# Altium project ESP32.PrjPcb
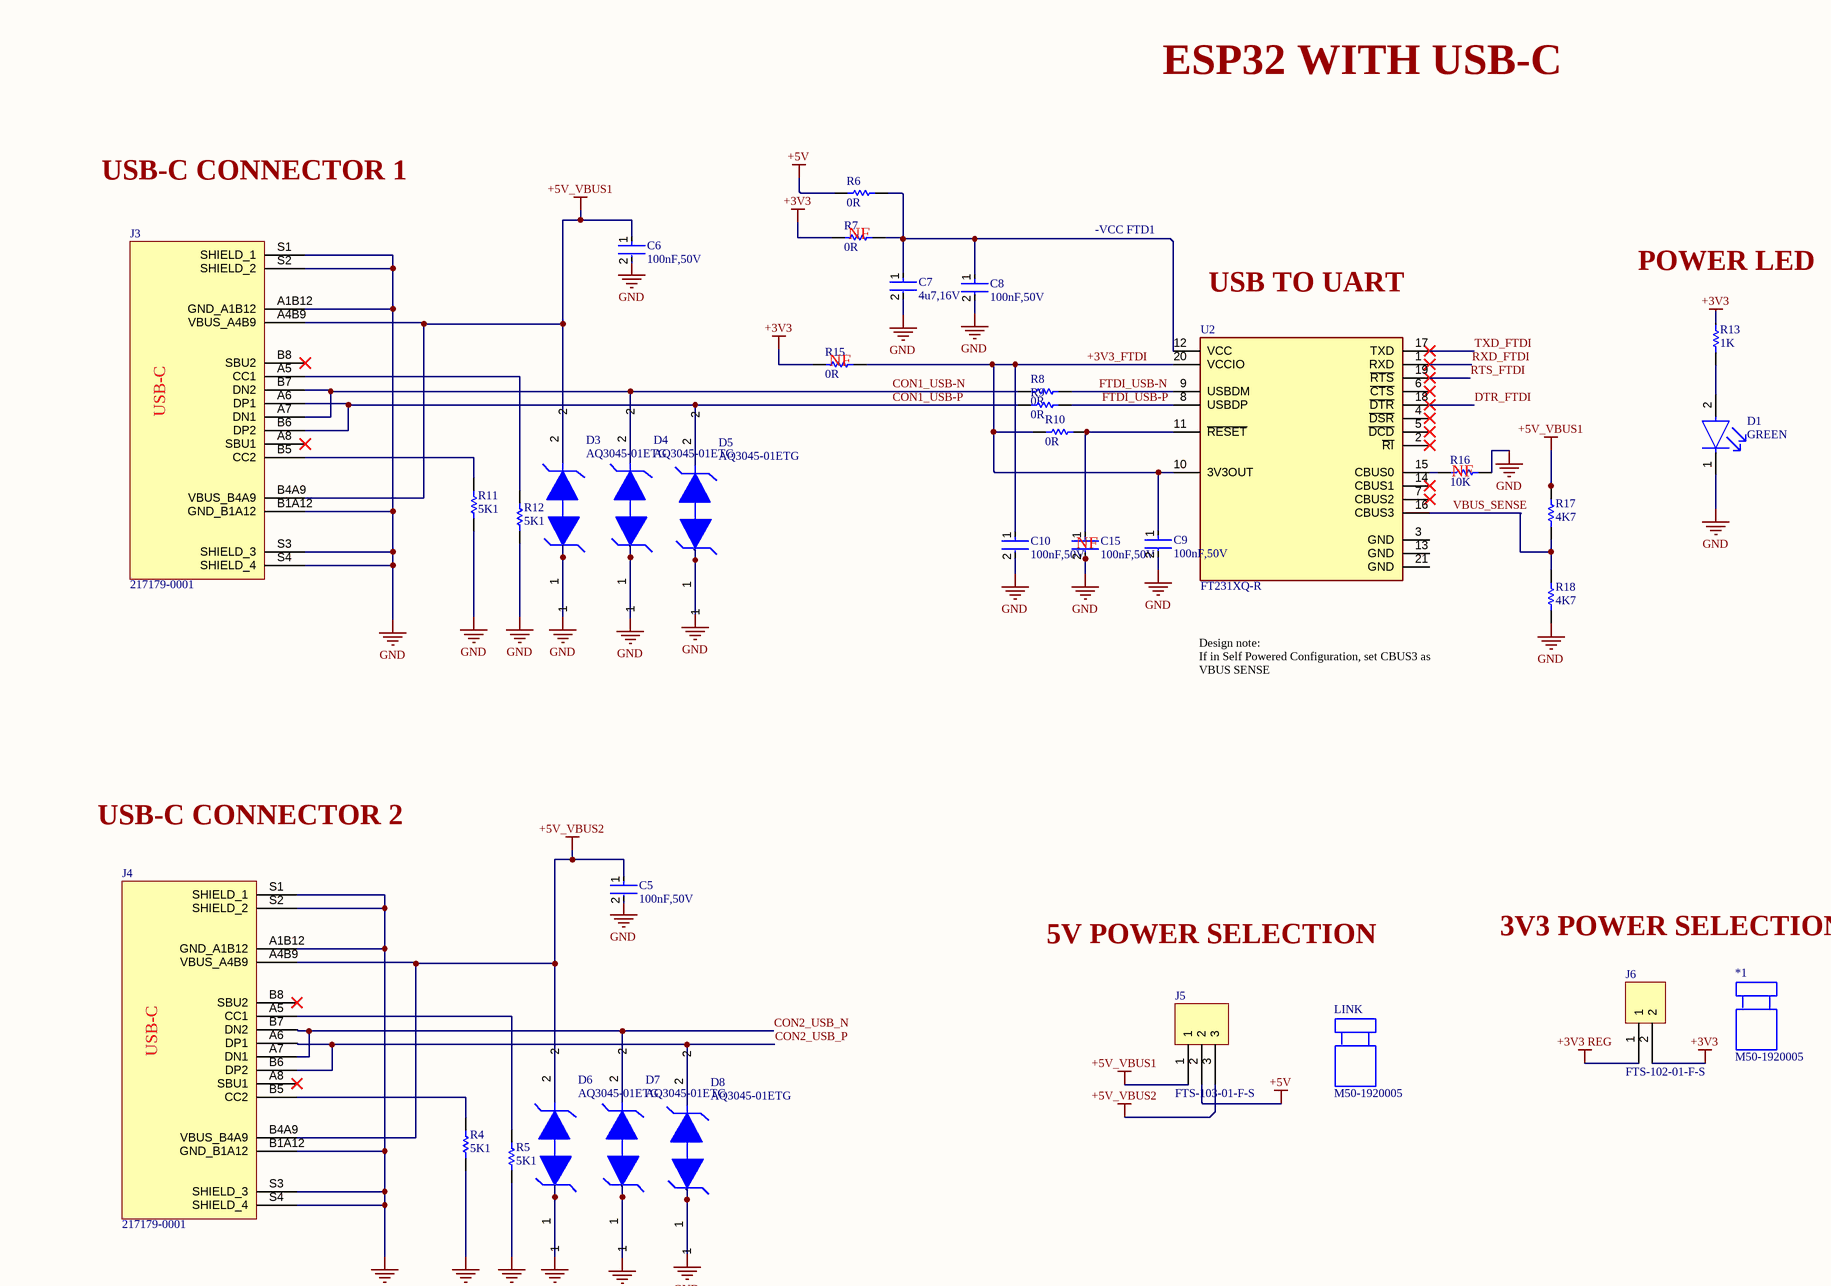
[diagram p0: Schematic.SchDoc, top left]
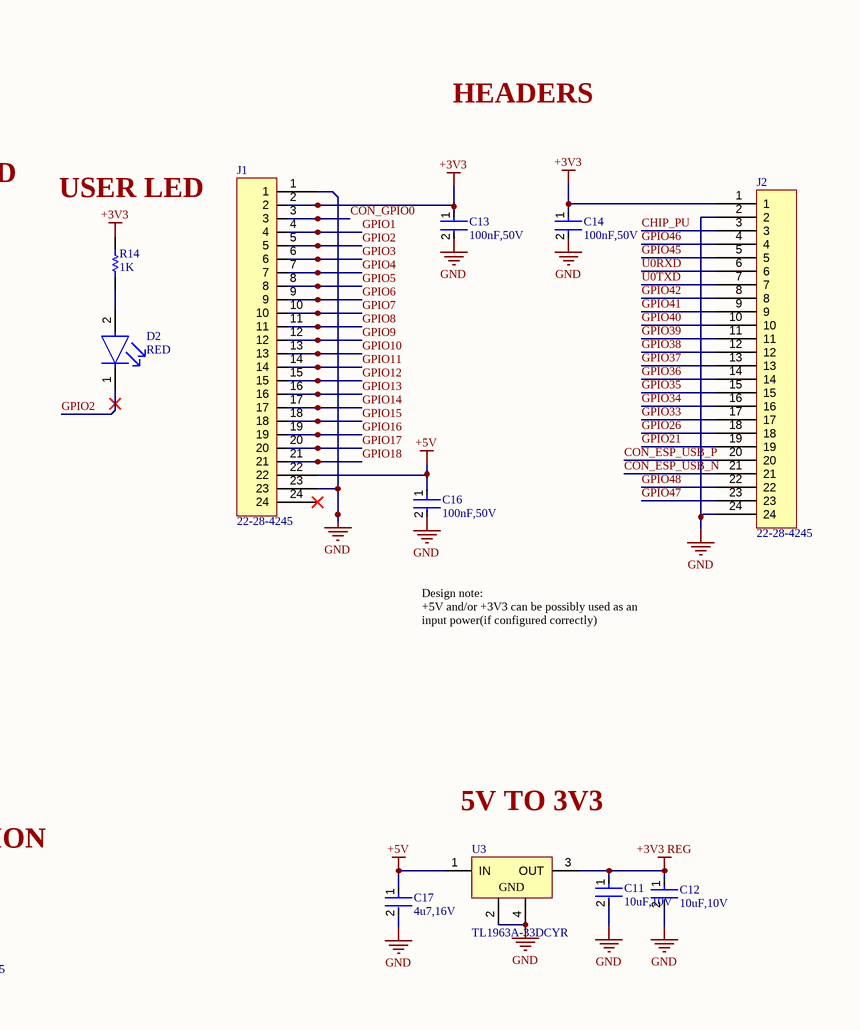
[diagram p1: Schematic.SchDoc, top right]
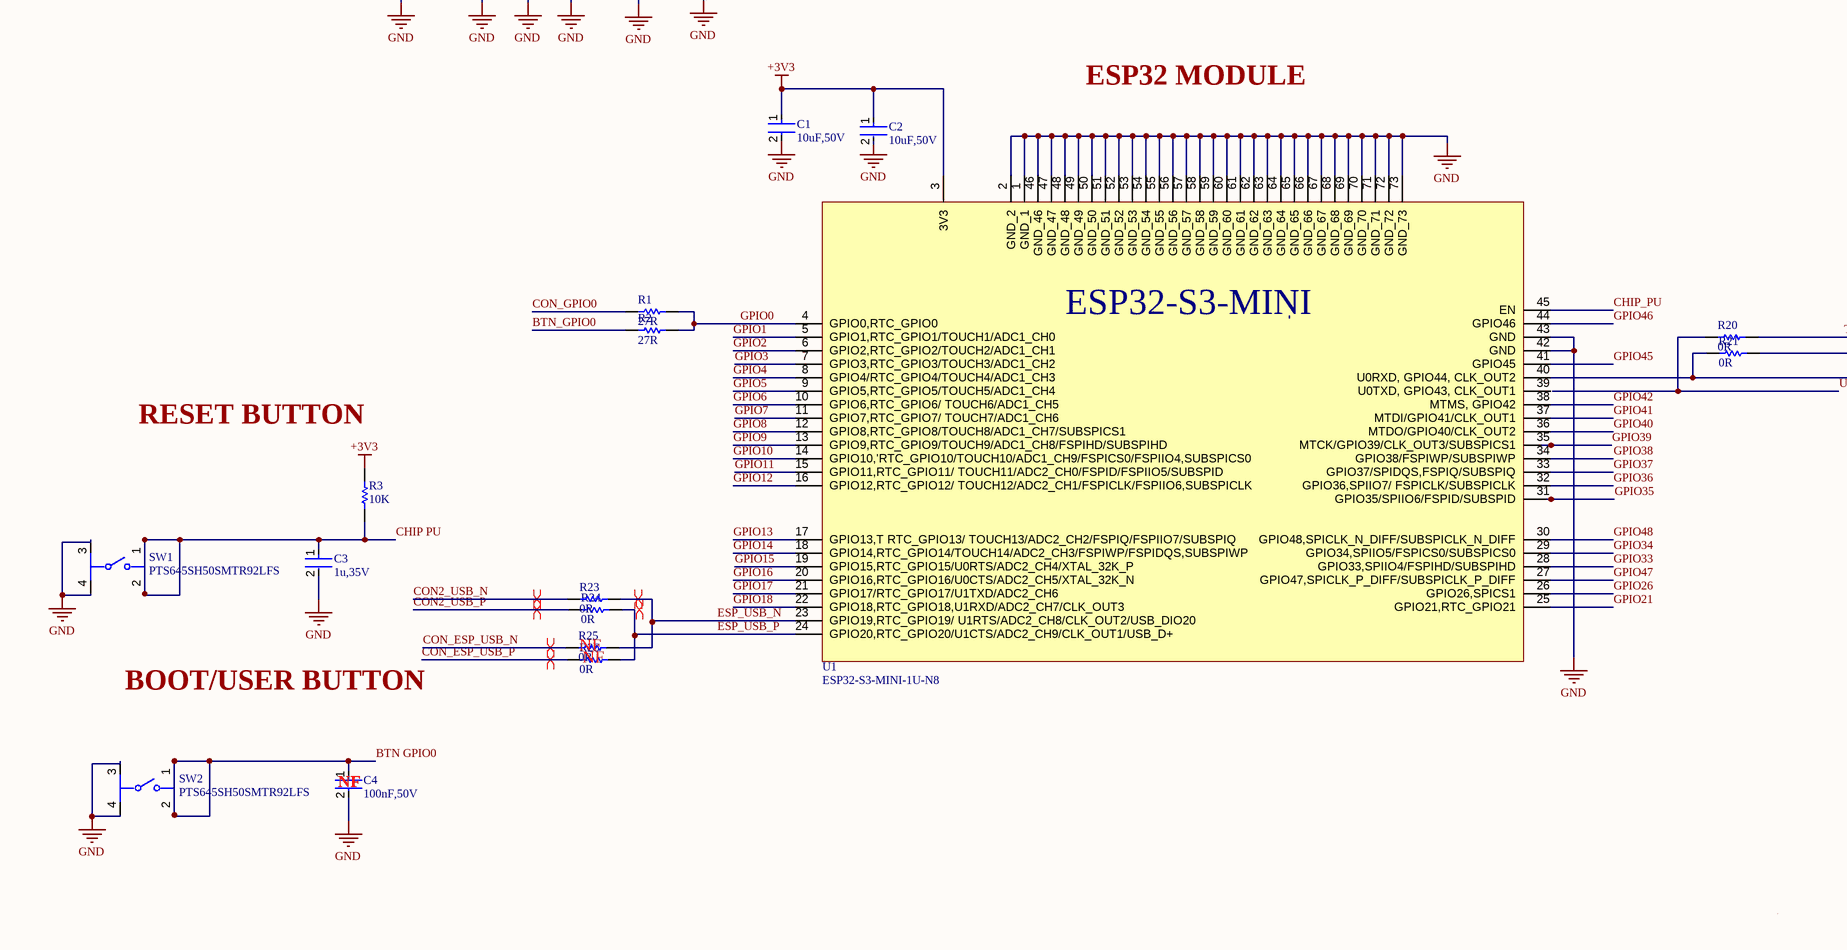
[diagram p2: Schematic.SchDoc, bottom left]
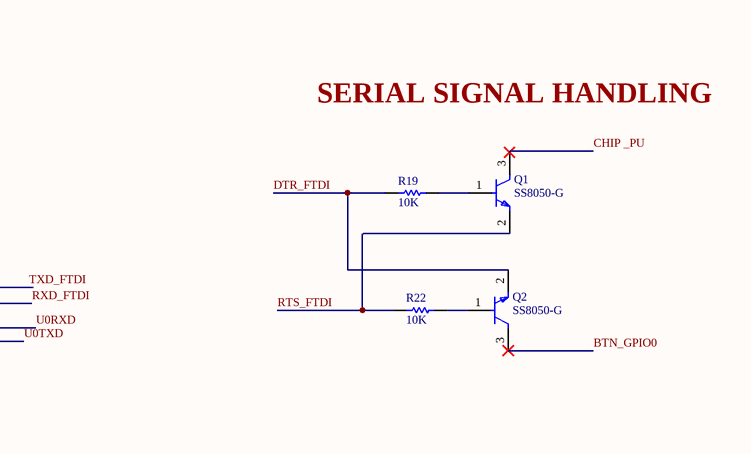
[diagram p3: Schematic.SchDoc, bottom right]
1 sheet, 66 parts. Net scope: global (net labels, ports and power ports of the same name join across sheets).
Board file: PCB.PcbDoc

## Sheet Schematic.SchDoc
size 558 x 431 mm; SheetNumber: 1; SheetTotal: 1

### Parts
*1  M50-1920005  (mechanical)
C1  10uF,50V  [FP-CL10-0_1-IPC_A]
C2  10uF,50V  [FP-CL10-0_1-IPC_A]
C3  1u,35V  [FP-CL10-0_1-IPC_A]
C4  100nF,50V  [FP-CL10-0_1-IPC_A]
C5  100nF,50V  [FP-CL10-0_1-IPC_A]
C6  100nF,50V  [FP-CL10-0_1-IPC_A]
C7  4u7,16V  [FP-CL10-0_1-IPC_A]
C8  100nF,50V  [FP-CL10-0_1-IPC_A]
C9  100nF,50V  [FP-CL10-0_1-IPC_A]
C10  100nF,50V  [FP-CL10-0_1-IPC_A]
C11  10uF,10V  [FP-CL10-0_1-IPC_A]
C12  10uF,10V  [FP-CL10-0_1-IPC_A]
C13  100nF,50V  [FP-CL10-0_1-IPC_A]
C14  100nF,50V  [FP-CL10-0_1-IPC_A]
C15  100nF,50V  [FP-CL10-0_1-IPC_A]
C16  100nF,50V  [FP-CL10-0_1-IPC_A]
C17  4u7,16V  [FP-CL10-0_1-IPC_A]
D1  GREEN  [FP-LTST-C190GKT-MFG]
D2  RED  [FP-LTST-C190GKT-MFG]
D3  AQ3045-01ETG  [SOD882]
D4  AQ3045-01ETG  [SOD882]
D5  AQ3045-01ETG  [SOD882]
D6  AQ3045-01ETG  [SOD882]
D7  AQ3045-01ETG  [SOD882]
D8  AQ3045-01ETG  [SOD882]
J1  22-28-4245  [HDR_1X24_2.54MM - duplicate]
J2  22-28-4245  [HDR_1X24_2.54MM - duplicate]
J3  217179-0001  [FP-2171790001-MFG]
J4  217179-0001  [FP-2171790001-MFG]
J5  FTS-103-01-F-S  [HDR_1X3_1.27MM - duplicate]
J6  FTS-102-01-F-S  [HDR_1X2_1.27MM]
LINK  M50-1920005  (mechanical)
Q1  SS8050-G  [FP-SS8050-G-IPC_B]
Q2  SS8050-G  [FP-SS8050-G-IPC_B]
R1  27R  [RESC1609X50X30LL8T20]
R2  27R  [RESC1609X50X30LL8T20]
R3  10K  [RESC1609X50X30LL8T20]
R4  5K1  [RESC1609X50X30LL8T20]
R5  5K1  [RESC1609X50X30LL8T20]
R6  0R  [RESC1609X50X30LL8T20]
R7  0R  [RESC1609X50X30LL8T20]
R8  0R  [RESC1609X50X30LL8T20]
R9  0R  [RESC1609X50X30LL8T20]
R10  0R  [RESC1609X50X30LL8T20]
R11  5K1  [RESC1609X50X30LL8T20]
R12  5K1  [RESC1609X50X30LL8T20]
R13  1K  [RESC1609X50X30LL8T20]
R14  1K  [RESC1609X50X30LL8T20]
R15  0R  [RESC1609X50X30LL8T20]
R16  10K  [RESC1609X50X30LL8T20]
R17  4K7  [RESC1609X50X30LL8T20]
R18  4K7  [RESC1609X50X30LL8T20]
R19  10K  [RESC1609X50X30LL8T20]
R20  0R  [RESC1609X50X30LL8T20]
R21  0R  [RESC1609X50X30LL8T20]
R22  10K  [RESC1609X50X30LL8T20]
R23  0R  [RESC1609X50X30LL8T20]
R24  0R  [RESC1609X50X30LL8T20]
R25  0R  [RESC1609X50X30LL8T20]
R26  0R  [RESC1609X50X30LL8T20]
SW1  PTS645SH50SMTR92LFS  [FP-PTS645SH50SMTR92LFS-MFG]
SW2  PTS645SH50SMTR92LFS  [FP-PTS645SH50SMTR92LFS-MFG]
U1  ESP32-S3-MINI-1U-N8  [XCVR_ESP32-S3-MINI-1-N8]
U2  FT231XQ-R  [FP-QFN-20-IPC_A]
U3  TL1963A-33DCYR  [DCY0004A_M]

### Nets
+3V3: C1.1 C2.1 C13.1 C14.1 J1.2 J2.1 J6.2 R3.2 R7.1 R13.2 R14.2 R15.1 U1.3(3V3)
+3V3 REG: C11.1 C12.1 J6.1 U3.3(OUT)
+5V: C16.1 C17.1 J1.22 J5.2 R6.1 U3.1(IN)
+5V_VBUS1: C6.1 D3.2 J3.A4B9(VBUS_A4B9) J3.B4A9(VBUS_B4A9) J5.1 R17.2
+5V_VBUS2: C5.1 D6.2 J4.A4B9(VBUS_A4B9) J4.B4A9(VBUS_B4A9) J5.3
GND: C1.2 C2.2 C3.2 C4.2 C5.2 C6.2 C7.2 C8.2 C9.2 C10.2 C11.2 C12.2 C13.2 C14.2 C15.2 C16.2 C17.2 D1.1(C) D3.1 D4.1 D5.1 D6.1 D7.1 D8.1 J1.1 J1.23 J2.2 J2.24 J3.A1B12(GND_A1B12) J3.B1A12(GND_B1A12) J3.S1(SHIELD_1) J3.S2(SHIELD_2) J3.S3(SHIELD_3) J3.S4(SHIELD_4) J4.A1B12(GND_A1B12) J4.B1A12(GND_B1A12) J4.S1(SHIELD_1) J4.S2(SHIELD_2) J4.S3(SHIELD_3) J4.S4(SHIELD_4) R4.1 R5.1 R11.1 R12.1 R16.2 R18.1 SW1.3 SW1.4 SW2.3 SW2.4 U1.1(GND_1) U1.2(GND_2) U1.42(GND) U1.43(GND) U1.46(GND_46) U1.47(GND_47) U1.48(GND_48) U1.49(GND_49) U1.50(GND_50) U1.51(GND_51) U1.52(GND_52) U1.53(GND_53) U1.54(GND_54) U1.55(GND_55) U1.56(GND_56) U1.57(GND_57) U1.58(GND_58) U1.59(GND_59) U1.60(GND_60) U1.61(GND_61) U1.62(GND_62) U1.63(GND_63) U1.64(GND_64) U1.65(GND_65) U1.66(GND_66) U1.67(GND_67) U1.68(GND_68) U1.69(GND_69) U1.70(GND_70) U1.71(GND_71) U1.72(GND_72) U1.73(GND_73) U3.2(GND) U3.4(GND)
+3V3_FTDI: C9.1 C10.1 R10.1 R15.2 U2.10(3V3OUT) U2.20(VCCIO)
BTN GPIO0: C4.1 SW2.1 SW2.2
BTN_GPIO0: Q2.3(C) R2.1
CHIP _PU: Q1.3(C)
CHIP PU: C3.1 R3.1 SW1.1 SW1.2
CHIP_PU: J2.3 U1.45(EN)
CON1_USB-N: D4.2 J3.A7(DN1) J3.B7(DN2) R8.1
CON1_USB-P: D5.2 J3.A6(DP1) J3.B6(DP2) R9.1
CON2_USB_N: D7.2 J4.A7(DN1) J4.B7(DN2) R23.1
CON2_USB_P: D8.2 J4.A6(DP1) J4.B6(DP2) R24.1
CON_ESP_USB_N: J2.21 R25.1
CON_ESP_USB_P: J2.20 R26.1
CON_GPIO0: J1.3 R1.1
DTR_FTDI: Q2.2(E) R19.2 U2.18(~{DTR})
ESP_USB_N: R23.2 R25.2 U1.23(GPIO19,RTC_GPIO19/_U1RTS/ADC2_CH8/CLK_OUT2/USB_DIO20)
ESP_USB_P: R24.2 R26.2 U1.24(GPIO20,RTC_GPIO20/U1CTS/ADC2_CH9/CLK_OUT1/USB_D+)
FTDI_USB-N: R8.2 U2.9(USBDM)
FTDI_USB-P: R9.2 U2.8(USBDP)
GPIO0: R1.2 R2.2 U1.4(GPIO0,RTC_GPIO0)
GPIO1: J1.4 U1.5(GPIO1,RTC_GPIO1/TOUCH1/ADC1_CH0)
GPIO2: D2.1(C) J1.5 U1.6(GPIO2,RTC_GPIO2/TOUCH2/ADC1_CH1)
GPIO3: J1.6 U1.7(GPIO3,RTC_GPIO3/TOUCH3/ADC1_CH2)
GPIO4: J1.7 U1.8(GPIO4/RTC_GPIO4/TOUCH4/ADC1_CH3)
GPIO5: J1.8 U1.9(GPIO5,RTC_GPIO5/TOUCH5/ADC1_CH4)
GPIO6: J1.9 U1.10(GPIO6,RTC_GPIO6/_TOUCH6/ADC1_CH5)
GPIO7: J1.10 U1.11(GPIO7,RTC_GPIO7/_TOUCH7/ADC1_CH6)
GPIO8: J1.11 U1.12(GPIO8,RTC_GPIO8/TOUCH8/ADC1_CH7/SUBSPICS1)
GPIO9: J1.12 U1.13(GPIO9,RTC_GPIO9/TOUCH9/ADC1_CH8/FSPIHD/SUBSPIHD)
GPIO10: J1.13 U1.14(GPIO10,'RTC_GPIO10/TOUCH10/ADC1_CH9/FSPICS0/FSPIIO4,SUBSPICS0)
GPIO11: J1.14 U1.15(GPIO11,RTC_GPIO11/_TOUCH11/ADC2_CH0/FSPID/FSPIIO5/SUBSPID)
GPIO12: J1.15 U1.16(GPIO12,RTC_GPIO12/_TOUCH12/ADC2_CH1/FSPICLK/FSPIIO6,SUBSPICLK)
GPIO13: J1.16 U1.17(GPIO13,T_RTC_GPIO13/_TOUCH13/ADC2_CH2/FSPIQ/FSPIIO7/SUBSPIQ)
GPIO14: J1.17 U1.18(GPIO14,RTC_GPIO14/TOUCH14/ADC2_CH3/FSPIWP/FSPIDQS,SUBSPIWP)
GPIO15: J1.18 U1.19(GPIO15,RTC_GPIO15/U0RTS/ADC2_CH4/XTAL_32K_P)
GPIO16: J1.19 U1.20(GPIO16,RTC_GPIO16/U0CTS/ADC2_CH5/XTAL_32K_N)
GPIO17: J1.20 U1.21(GPIO17/RTC_GPIO17/U1TXD/ADC2_CH6)
GPIO18: J1.21 U1.22(GPIO18,RTC_GPIO18,U1RXD/ADC2_CH7/CLK_OUT3)
GPIO21: J2.19 U1.25(GPIO21,RTC_GPIO21)
GPIO26: J2.18 U1.26(GPIO26,SPICS1)
GPIO33: J2.17 U1.28(GPIO33,SPIIO4/FSPIHD/SUBSPIHD)
GPIO34: J2.16 U1.29(GPIO34,SPIIO5/FSPICS0/SUBSPICS0)
GPIO35: J2.15 U1.31(GPIO35/SPIIO6/FSPID/SUBSPID)
GPIO36: J2.14 U1.32(GPIO36,SPIIO7/_FSPICLK/SUBSPICLK)
GPIO37: J2.13 U1.33(GPIO37/SPIDQS,FSPIQ/SUBSPIQ)
GPIO38: J2.12 U1.34(GPIO38/FSPIWP/SUBSPIWP)
GPIO39: J2.11 U1.35(MTCK/GPIO39/CLK_OUT3/SUBSPICS1)
GPIO40: J2.10 U1.36(MTDO/GPIO40/CLK_OUT2)
GPIO41: J2.9 U1.37(MTDI/GPIO41/CLK_OUT1)
GPIO42: J2.8 U1.38(MTMS,_GPIO42)
GPIO45: J2.5 U1.41(GPIO45)
GPIO46: J2.4 U1.44(GPIO46)
GPIO47: J2.23 U1.27(GPIO47,SPICLK_P_DIFF/SUBSPICLK_P_DIFF)
GPIO48: J2.22 U1.30(GPIO48,SPICLK_N_DIFF/SUBSPICLK_N_DIFF)
RTS_FTDI: Q1.2(E) R22.2 U2.19(~{RTS})
RXD_FTDI: R21.2 U2.1(RXD)
TXD_FTDI: R20.2 U2.17(TXD)
U0RXD: J2.6 R21.1 U1.40(U0RXD,_GPIO44,_CLK_OUT2)
U0TXD: J2.7 R20.1
VBUS_SENSE: R17.1 R18.2 U2.16(CBUS3)
NetC7_1: C7.1 C8.1 R6.2 R7.2 U2.12(VCC)
NetC15_1: C15.1 R10.2 U2.11(~{RESET})
NetD1_2: D1.2(A) R13.1
NetD2_2: D2.2(A) R14.1
NetJ3_A5: J3.A5(CC1) R12.2
NetJ3_B5: J3.B5(CC2) R11.2
NetJ4_A5: J4.A5(CC1) R5.2
NetJ4_B5: J4.B5(CC2) R4.2
NetQ1_1: Q1.1(B) R19.1
NetQ2_1: Q2.1(B) R22.1
NetR16_1: R16.1 U2.15(CBUS0)

Not connected (* = marked no-connect by the designer): J1 24*; J3 A8(SBU1)* B8(SBU2)*; J4 A8(SBU1)* B8(SBU2)*; U1 39(U0TXD,_GPIO43,_CLK_OUT1); U2 2(~{RI})* 3(GND) 4(~{DSR})* 5(~{DCD})* 6(~{CTS})* 7(CBUS2)* 13(GND) 14(CBUS1)* 21(GND)

### Layout directives
differential pair; differential pair class DIFF90: CON2_USB_N, CON2_USB_P, CON_ESP_USB_N, CON_ESP_USB_P, ESP_USB_N, ESP_USB_P

### Notes on the sheet
- ESP32 WITH USB-C
- USB-C CONNECTOR 1
- HEADERS
- (near R7) NF
- -VCC FTD1
- (near U2) USB TO UART
- (near R13) POWER LED
- (near R14) USER LED
- (near R15) NF
- (near R16) NF
- (near C15) NF
- Design note:
  If in Self Powered Configuration, set CBUS3 as VBUS SENSE
- Design note:
  +5V and/or +3V3 can be possibly used as an input power(if configured correctly)
- USB-C CONNECTOR 2
- 5V TO 3V3
- 5V POWER SELECTION
- (near *1) 3V3 POWER SELECTION
- ESP32 MODULE
- SERIAL SIGNAL HANDLING
- RESET BUTTON
- NF
- BOOT/USER BUTTON
- (near C4) NF
- DWG. NO.
- REV.
- SHT.
- REVISION
- DESCRIPTION
- DATE
- APPROVED
- THIS DOCUMENT AND THE DATA DISCLOSED HEREIN OR HEREWITH IS THE PROPERTY OF ALTIUM LIMITED AND MAY BE FREELY DISTRIBUTED IN WHOLE. NO RIGHTS ARE RESERVED OR EXPRESS OR IMPLIED WARANTEE GIVEN.
- ENG:
- DSN:
- APPROVALS
- PROJECT
- DOCUMENT REVISION:
- DESIGN ITEM:
- CHK:
- BOM:
- REFERENCE DOCUMENTS
- PROJECT REVISION:
- TITLE
- FAB DWG:
- PCB DWG:
- ASSY DWG:
- SCALE:
- SIZE
- C
- CAGE CODE
- FILE NAME
- DWG NO.
- SHEET
- OF
- REV
- (in symbol 217179-0001) USB-C
- (in symbol ESP32-S3-MINI-1U-N8) ESP32-S3-MINI

### Library data of the parts
*1 LINK = M50-1920005: Jumper (Busbar), Jumper Socket, Pin Headers, 2, 1.27 Mm Rohs Compliant: Yes |Harwin M50-1920005; Manufacturer: Harwin; Supplier: Digikey; Supplier Part Number: 952-1727-ND; Manufacturer Part Number: M50-1920005; RoHS: Yes; Category: Headers and Wire Housings; Stock: 4363; Pricing: 1=0.33, 10=0.284, 25=0.2664, 50=0.2536, 100=0.2414, 250=0.22628, 500=0.21546, 1000=0.20516, 3000=0.18984 (USD); ComponentLink1URL: https://datasheet.ciiva.com/4573/m50-19x-350826-4573042.pdf?src-supplier=Mouser; ComponentLink1Description: https://datasheet.ciiva.com/4573/m50-19x-350826-4573042.pdf?src-supplier=Mouser; ComponentLink2URL: https://datasheet.ciiva.com/1456/m50-19x-1456640.pdf?src-supplier=Newark; ComponentLink2Description: https://datasheet.ciiva.com/1456/m50-19x-1456640.pdf?src-supplier=Newark; ComponentLink3URL: https://datasheet.ciiva.com/1412/1836978-1412125.pdf?src-supplier=Element14; ComponentLink3Description: https://datasheet.ciiva.com/1412/1836978-1412125.pdf?src-supplier=Element14; ComponentLink4URL: https://datasheet.ciiva.com/767/m50-19x-767921.pdf?src-supplier=Digikey; ComponentLink4Description: https://datasheet.ciiva.com/767/m50-19x-767921.pdf?src-supplier=Digikey
C1-C3 C7 C11 C12 C17 = CMP-13271-000011-1: CAP CER 0.1UF 50V X7R 0603; Manufacturer: Samsung Electro-Mechanics America, Inc; Manufacturer Part Number: CL10B104JB8NNNC; Value: 100nF; Material: Ceramic; Temperature Coefficient: 15%; Tolerance: 5%; Ipc Land Pattern Name: CAPC16080X80; Device Class L1: Passive Components; Digikey Description: CAP CER 0.1UF 50V X7R 0603; Voltage Rating: 50V; Height: 0.9mm; ComponentLink2Description: Datasheet; Device Class L2: Capacitors; ComponentLink2URL: http://www.samsungsem.com/kr/support/product-search/mlcc/__icsFiles/afieldfile/2019/06/18/CL10B104JB8NNNC-19.pdf; Temperature Characteristic: X7R; Temperature Range High: +125°C; Lead Free: Yes; Temperature Range Low: -55°C; Category: Cap; Package: CL10-0.1; Temperature: -55°C to +125°C; Octopart: https://octopart.com/cl10b104jb8nnnc-samsung-9302151; Device Class L3: Ceramic Capacitors; RoHS: TRUE; Automotive: No; Capacitance: 100nF
C4-C6 C8-C10 C13-C16 = CMP-13271-000011-1: CAP CER 0.1UF 50V X7R 0603; Manufacturer: Samsung Electro-Mechanics America, Inc; Manufacturer Part Number: CL10B104JB8NNNC; Material: Ceramic; Temperature Coefficient: 15%; Tolerance: 5%; Ipc Land Pattern Name: CAPC16080X80; Device Class L1: Passive Components; Digikey Description: CAP CER 0.1UF 50V X7R 0603; Voltage Rating: 50V; Height: 0.9mm; ComponentLink2Description: Datasheet; Device Class L2: Capacitors; ComponentLink2URL: http://www.samsungsem.com/kr/support/product-search/mlcc/__icsFiles/afieldfile/2019/06/18/CL10B104JB8NNNC-19.pdf; Temperature Characteristic: X7R; Value: 100nF; Temperature Range High: +125°C; Lead Free: Yes; Temperature Range Low: -55°C; Category: Cap; Package: CL10-0.1; Temperature: -55°C to +125°C; Octopart: https://octopart.com/cl10b104jb8nnnc-samsung-9302151; Device Class L3: Ceramic Capacitors; RoHS: TRUE; Automotive: No; Capacitance: 100nF
D1 D2 = CMP-22017-000005-2: LED GREEN CLEAR CHIP SMD; Dominant Wavelength: 569nm; Reverse Voltage: 5V; Lens Color: Colorless; Viewing Angle: 130°; Voltage: 2V; Forward Current: 30mA; Power Dissipation: 100mW; Luminous Intensity: 6mcd; Number of LEDs: 1; Forward Voltage: 2.1V; Wavelength: 565nm; Test Current: 10mA; Min Operating Temperature: -55°C; Lens Style: Clear; Mount: Surface Mount; Width: 0.8mm; Packaging: Tape and Reel; Lens Transparency: Clear; Case Code (Metric): 1608; Depth: 0.8mm; Case Code (Imperial): 0603; Case/Package: 0603; Number of Pins: 2; Max Operating Temperature: 85°C; Lead Free: Lead Free; Number of Elements: 1; Length: 1.6mm; Height: 0.8mm; Package Quantity: 1; Power Rating: 100mW; Radiation Hardening: No; Illumination Color: Green; Color: Green
D3-D8 = AQ3045-01ETG: TVS DIODE 12VC 3A SOD882 / ESD Suppressor TVS Bi-Dir 5.3V Automotive 2-Pin SOD-882 T/R; Manufacturer: Littelfuse; Number of Bidirectional Channels: 1; Min Breakdown Voltage: 6.8V; Peak Pulse Power: 40W; Power Line Protection: No; Diode Type: ZENER; Leakage Current: 100nA; Number of Channels: 1NUMBER; Supplier: Digikey; Supplier Part Number: F9321DKR-ND; Manufacturer Part Number: AQ3045-01ETG; RoHS: Yes; Category: TVS Diodes; Stock: 7460; Pricing: 1=0.45, 10=0.29, 100=0.141, 500=0.134, 1000=0.131 (USD); Mounting Technology: Surface Mount; Min Operating Temperature: -55°C; Max Operating Temperature: 150°C; Packaging: Cut Tape; Reverse Standoff Voltage: 5.3V; Peak Pulse Current: 3A; Series: Automotive, AEC-Q101, AQ3045, SPA®; Operating Supply Voltage: 5.3V; RoHS Compliant: Yes; ComponentLink1URL: https://www.littelfuse.com/~/media/electronics/datasheets/tvs_diode_arrays/littelfuse_tvs_diode_array_aq3045_datasheet.pdf.pdf?src-supplier=Digikey; ComponentLink1Description: https://www.littelfuse.com/~/media/electronics/datasheets/tvs_diode_arrays/littelfuse_tvs_diode_array_aq3045_datasheet.pdf.pdf?src-supplier=Digikey; ComponentLink2URL: http://www.littelfuse.com/~/media/electronics/datasheets/tvs_diode_arrays/littelfuse_tvs_diode_array_aq3045_datasheet.pdf.pdf?src-supplier=Digikey; ComponentLink2Description: http://www.littelfuse.com/~/media/electronics/datasheets/tvs_diode_arrays/littelfuse_tvs_diode_array_aq3045_datasheet.pdf.pdf?src-supplier=Digikey
J1 J2 = 22-28-4245: Conn Unshrouded Header HDR 24 POS 2.54mm Solder ST Thru-Hole KK® Bag; Manufacturer: Molex; Plating: Tin; Current Rating: 4A; Gender: Male; Number of Circuits: 24; Supplier: Digikey; Supplier Part Number: 900-0022284245-ND; Manufacturer Part Number: 22-28-4245; RoHS: No; Category: Headers and Wire Housings; Stock: 1547; Pricing: 1=1.21, 10=1.024, 100=0.8699, 500=0.77638, 1000=0.73932, 5000=0.65998, 10000=0.62851 (USD); Mounting Technology: Through Hole; Contact Material: Brass; Contact Plating: Gold; Housing Color: Black; Number of Contacts: 24; Number of Positions: 24; Number of Rows: 1; Orientation: Vertical; Packaging: Bulk; Termination: Solder; Pitch: 2.54mm; Lead Free: Lead Free; Reach SVHC Compliant: 4188SVHC; ComponentLink1URL: https://datasheet.ciiva.com/6814/022284363-sd-6814049.pdf?src-supplier=Digikey; ComponentLink1Description: https://datasheet.ciiva.com/6814/022284363-sd-6814049.pdf?src-supplier=Digikey; ComponentLink2URL: https://datasheet.ciiva.com/10075/0022284245-pcb-headers-10075617.pdf?src-supplier=Avnet; ComponentLink2Description: https://datasheet.ciiva.com/10075/0022284245-pcb-headers-10075617.pdf?src-supplier=Avnet; ComponentLink3URL: https://datasheet.ciiva.com/1433/1597854-1433759.pdf?src-supplier=Element14; ComponentLink3Description: https://datasheet.ciiva.com/1433/1597854-1433759.pdf?src-supplier=Element14
J3 J4 = 217179-0001: USB Connector, USB Type C, USB 2.0, Receptacle, 16 Ways, Surface Mount, Through Hole Mount; Manufacturer: Molex; USB Standard: USB 2.0; Current Rating: 1.25A; Number of Contacts: 16; Voltage Rating: 30V; Supplier: Digikey; Supplier Part Number: 900-2171790001CT-ND; Manufacturer Part Number: 217179-0001; RoHS: No; Category: Connectors; Stock: 19280; Pricing: 1=0.83, 10=0.704, 25=0.6596, 50=0.628, 100=0.598, 250=0.56052, 500=0.53374 (USD); Contact Material: Nickel,Gold; Min Operating Temperature: -40°C; Max Operating Temperature: 85°C; Gender: Receptacle; Height: 3.36mm
J5 = FTS-103-01-F-S: Pin Header, Wire-to-Board, 1.27 mm, 1 Rows, 3 Contacts, Through Hole, FTS; Manufacturer: Samtec; Gender: 29Gender; Supplier: Digikey; Supplier Part Number: 612-FTS-103-01-F-S-ND; Manufacturer Part Number: FTS-103-01-F-S; RoHS: Yes; Category: Connectors; Pricing: 1=0.73, 50=0.6378, 100=0.5407, 500=0.4491, 1000=0.384 (USD); ComponentLink1URL: http://www.samtec.com/documents/webfiles/pdf/FTS.pdf?src-supplier=Avnet; ComponentLink1Description: http://www.samtec.com/documents/webfiles/pdf/FTS.pdf?src-supplier=Avnet; ComponentLink2URL: http://suddendocs.samtec.com/prints/fts-1xx-xx-xx-xx-xx-mkt.pdf?src-supplier=Digikey; ComponentLink2Description: http://suddendocs.samtec.com/prints/fts-1xx-xx-xx-xx-xx-mkt.pdf?src-supplier=Digikey; ComponentLink3URL: https://datasheet.octopart.com/FTS-103-01-F-S-Samtec-datasheet-116535195.pdf?src-supplier=Toby+Electronics; ComponentLink3Description: https://datasheet.octopart.com/FTS-103-01-F-S-Samtec-datasheet-116535195.pdf?src-supplier=Toby+Electronics; ComponentLink4URL: https://datasheet.octopart.com/FTS-103-01-F-S-Samtec-datasheet-151470456.pdf?src-supplier=Sager+Electronics; ComponentLink4Description: https://datasheet.octopart.com/FTS-103-01-F-S-Samtec-datasheet-151470456.pdf?src-supplier=Sager+Electronics; ComponentLink5URL: https://datasheet.octopart.com/FTS-103-01-F-S-Samtec-datasheet-118493358.pdf?src-supplier=Electro+Sonic; ComponentLink5Description: https://datasheet.octopart.com/FTS-103-01-F-S-Samtec-datasheet-118493358.pdf?src-supplier=Electro+Sonic
J6 = FTS-102-01-F-S: Pin Header, Board-to-Board, 1.27 mm, 1 Rows, 2 Contacts, Through Hole Straight, FTS Series; Manufacturer: Samtec; Number of Contacts: 2; Gender: Male; Pitch: 1.27mm; Supplier: Digikey; Supplier Part Number: SAM15176-ND; Manufacturer Part Number: FTS-102-01-F-S; RoHS: Yes; Category: Connectors; Stock: 35; Pricing: 1=0.49, 50=0.4252, 100=0.3608, 500=0.2994, 1000=0.25609, 2000=0.252 (USD); Mounting Technology: Through Hole; Contact Plating: Gold; Contact Material: Bronze; Contact Shape: Square; Contact Finish - Mating: GOLD; Insulation Material: Polymer; Insulation Color: Black; Min Operating Temperature: -55°C; Max Operating Temperature: 125°C; Number of Rows: 1; Packaging: Bulk; Termination: Solder; Fastening Type: Pull; Series: FTS; Contact Type: Male Pin; Number of Positions: 2; Radiation Hardening: No; RoHS Compliant: Yes; Flammability Rating: UL94 V-0; ComponentLink1URL: http://www.samtec.com/documents/webfiles/pdf/FTS.pdf?src-supplier=Avnet; ComponentLink1Description: http://www.samtec.com/documents/webfiles/pdf/FTS.pdf?src-supplier=Avnet; ComponentLink2URL: https://datasheet.octopart.com/FTS-102-01-F-S-Samtec-datasheet-118493358.pdf?src-supplier=Electro+Sonic; ComponentLink2Description: https://datasheet.octopart.com/FTS-102-01-F-S-Samtec-datasheet-118493358.pdf?src-supplier=Electro+Sonic
Q1 Q2 = CMP-20235-000001-1: NPN TRANSISTOR 1.5A 40V SOT-23 R; Transition Frequency: 100MHz; Max Breakdown Voltage: 25V; Collector Emitter Voltage (VCEO): 400mV; Max Power Dissipation: 300mW; Max Collector Current: 1.5A; Case/Package: TO-236-3; Packaging: Tape and Reel; RoHS Compliant: Yes; Mount: Surface Mount; Collector Emitter Breakdown Voltage: 25V
R1-R26 = CMP-1666-00005-4: Chip Resistor, 10 KOhm, +/- 1%, 100 mW, -55 to 155 degC, 0603 (1608 Metric), RoHS, Tape and Reel; Manufacturer: Vishay Semiconductor; Voltage Rating: 75 V; Max Operating Temperature: 155 degC; PackageDescription: 2-Pin Surface Mount Device, Body 1.575 x 0.85 mm; ComponentLink1Description: Manufacturer URL; RoHSCompliant: true; PackageReference: 0603; REACH SVHC: Unknown; Length: 1.55 mm; DatasheetVersion: 06/2012; Packaging: Tape and Reel; Min Operating Temperature: -55 degC; Mounting Technology: Surface Mount; ComponentLink2URL: https://datasheet.ciiva.com/11809/0900766b80d98afc-11809037.pdf; Height: 0.45 mm; ComponentLink2Description: Datasheet; Package Quantity: 5000; ComponentLink1URL: http://www.vishay.com/
SW1 SW2 = CMP-10040-000028-1: SWITCH TACTILE SPST-NO 0.05A 12V; Operating Force: 200gf; Current Rating: 50mA; Illumination Type: Non-Illuminated; Actuator Material: Nylon; Throw Configuration: SPST; Switch Function: Off-Mom; Mechanical Life: 100000Cycles; Actuator Type: Standard; Packaging: Tape and Reel; Termination: Gull Wing; Max Operating Temperature: 60°C; Length: 6mm; REACH SVHC: No SVHC; Orientation: Straight; Max Voltage Rating (DC): 12V; Package Quantity: 1000; Max Current Rating: 50mA; Mount: Surface Mount; Contact Material: Bronze; Case/Package: SMD/SMT; Lead Free: Lead Free; Min Operating Temperature: -20°C; Contact Plating: Silver; Color: Black; Depth: 9mm; Voltage Rating (DC): 12V
U1 = ESP32-S3-MINI-1U-N8: WiFi-Module 802.11 2, 4GHz 150Mb/s; Manufacturer: Espressif Systems; Supplier: Digikey; Supplier Part Number: 1965-ESP32-S3-MINI-1U-N8CT-ND; Manufacturer Part Number: ESP32-S3-MINI-1U-N8; RoHS: No; Category: LDO; Stock: 576; Pricing: 1=5.28, 10=4.566, 25=4.3196, 100=3.9802, 250=3.7768 (USD); ComponentLink1URL: https://datasheet.octopart.com/ESP32-S3-MINI-1U-N8-Espressif-Systems-datasheet-165560562.pdf?src-supplier=TME; ComponentLink1Description: https://datasheet.octopart.com/ESP32-S3-MINI-1U-N8-Espressif-Systems-datasheet-165560562.pdf?src-supplier=TME
U2 = CMP-0248-00001-3: IC USB SERIAL FULL UART 20QFN; Data Rate: 12Mbps; Operating Supply Current: 8mA; Min Supply Voltage: 2.97V; Max Supply Voltage: 5.5V; Number of Channels: 1; Min Operating Temperature: -40°C; Case/Package: QFN; Mount: Surface Mount; Number of Pins: 20; Interface: UART; Lead Free: Lead Free; Package Quantity: 5000; Weight: 0.004339oz; Packaging: Tape and Reel; Max Operating Temperature: 85°C
U3 = CMP-0395-00535-2: Single Output Low Noise LDO, 1.5 A, Fixed 3.3 V Output, 2.1 to 20 V Input, 4-pin SOT-223 (DCY), -40 to 125 degC, Green (RoHS & no Sb/Br); Manufacturer: Texas Instruments; Vout Adj(Min)(V): 3.3; Vin(Max)(V): 20; SubFamily: Single Channel LDO; Iq(Typ)(mA): 1; Iout(Max)(A): 1.5; Vin(Min)(V): 2.1; Vdo(Typ)(mV): 340; Accuracy(%): 3; ComponentLink2Description: Datasheet; PackageVersion: 4202506/B; PackageReference: DCY0004A; ComponentLink1Description: Manufacturer URL; Eco-Plan: Green (RoHS & no Sb/Br); ComponentLink1URL: http://www.ti.com/; Fixed Output Options(V): 3.3; ComponentLink2URL: http://www.ti.com/general/docs/lit/getliterature.tsp?genericPartNumber=TL1963A-33&fileType=pdf; Vout Adj(Max)(V): 3.3; PackageDescription: 4-Pin Plastic Small Outline, Body 3.5 x 6.5 mm, Pitch 2.3 mm; ComponentLink3URL: http://www.ti.com/litv/pdf/mpds094a; DatasheetVersion: SLVS719F; PartNumber: TL1963A-33DCYR; Code_JEDEC: TO-261; Mounting Technology: Surface Mount; ComponentLink3Description: Package Specification